# EAGLE design nano (EAGLE 7.6.0)
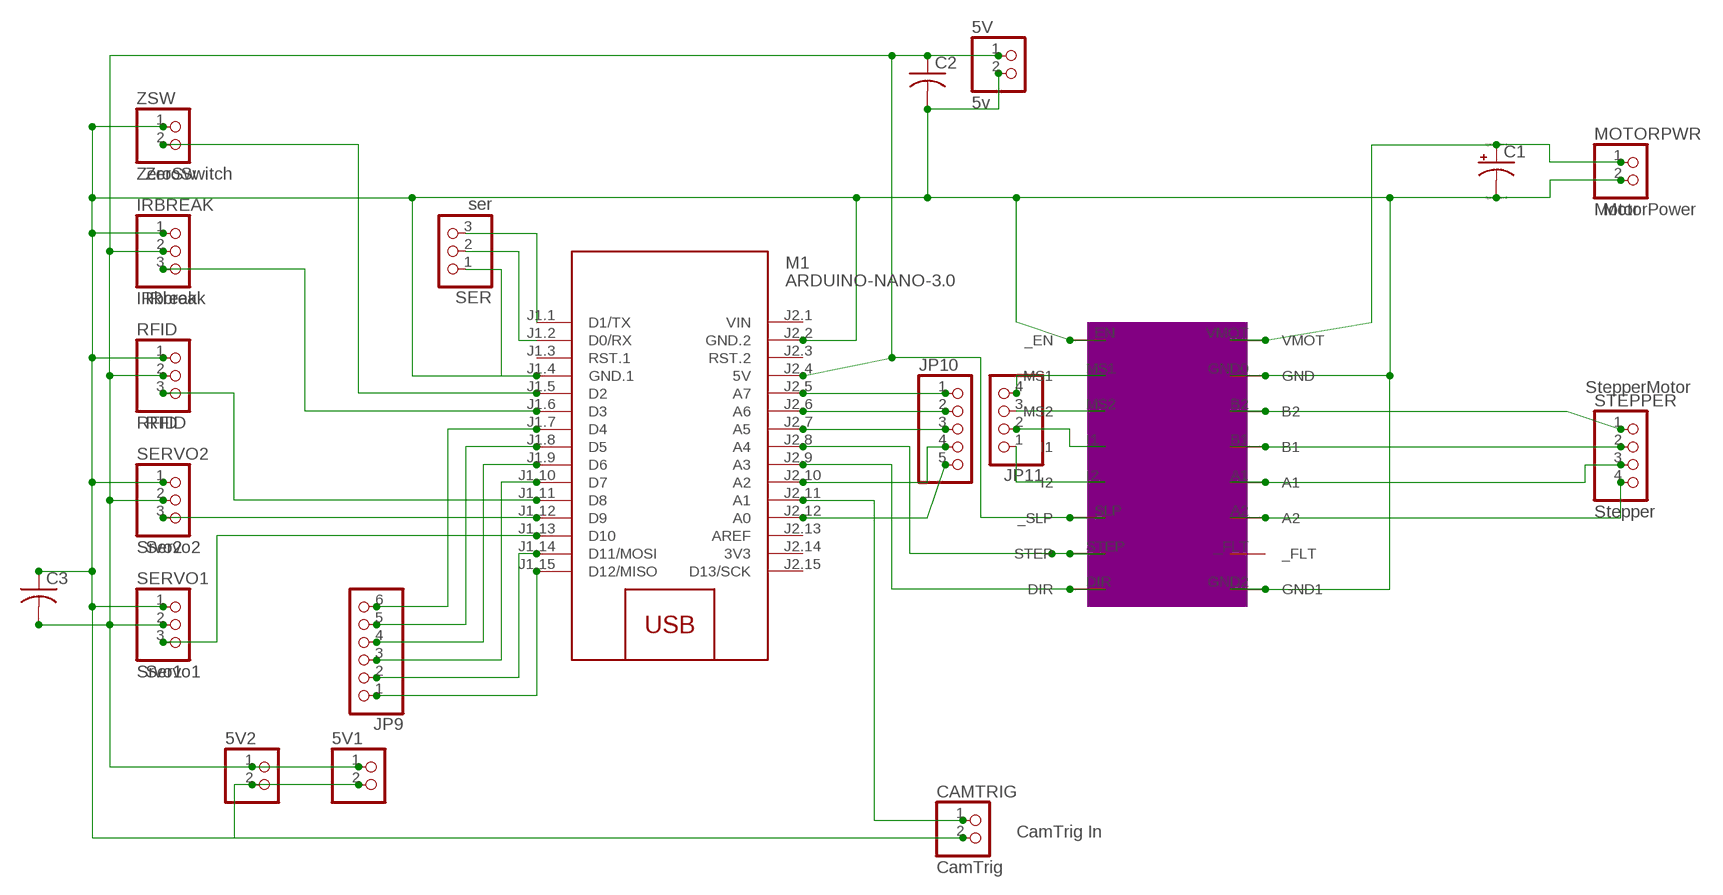
[diagram p0: schematic, sheet 1]

## Parts
5V  5v  PINHD-1X2  [1X02]
5V1  PINHD-1X2  [1X02]
5V2  PINHD-1X2  [1X02]
C1  CPOL-USE5-5  [E5-5]
C2  C-USC0805  [C0805]
C3  C-USC0805  [C0805]
CAMTRIG  CamTrig  PINHD-1X2  [1X02]
IRBREAK  IRbreak  PINHD-1X3  [1X03]
JP9  PINHD-1X6  [1X06]
JP10  PINHD-1X5  [1X05]
JP11  PINHD-1X4  [1X04]
M1  ARDUINO-NANO-3.0  [ARDUINO-NANO-3.0]
MOTORPWR  Motor  PINHD-1X2  [1X02]
RFID  RFID  PINHD-1X3  [1X03]
SER  ser  PINHD-1X3  [1X03]
SERVO1  Srvo1  PINHD-1X3  [1X03]
SERVO2  Srvo2  PINHD-1X3  [1X03]
STEPPER  Stepper  PINHD-1X4  [1X04]
U$1  MP6500  [MP6500]
ZSW  ZeroSw  PINHD-1X2  [1X02]

## Nets
N$1: C1.+ MOTORPWR.1 U$1.VMOT
N$2: JP9.1 M1.J1.15(D12/MISO)
N$3: JP11.4 U$1.MS1
N$4: STEPPER.4 U$1.A2
N$5: STEPPER.3 U$1.A1
N$6: STEPPER.2 U$1.B1
N$7: STEPPER.1 U$1.B2
N$8: JP9.2 M1.J1.14(D11/MOSI)
N$9: JP9.3 M1.J1.10(D7)
N$10: M1.J1.12(D9) SERVO2.3
N$11: M1.J1.13(D10) SERVO1.3
N$12: M1.J1.5(D2) ZSW.2
N$13: IRBREAK.3 M1.J1.6(D3)
N$14: M1.J1.11(D8) RFID.3
N$15: CAMTRIG.1 M1.J2.11(A1)
N$16: M1.J2.9(A3) U$1.DIR
N$17: M1.J2.8(A4) U$1.STEP
N$18: JP9.4 M1.J1.9(D6)
N$19: 5V1.1 5V2.1 5V.1 C2.1 C3.2 IRBREAK.2 M1.J2.4(5V) RFID.2 SERVO1.2 SERVO2.2 U$1._SLP
N$20: JP9.5 M1.J1.8(D5)
N$21: JP9.6 M1.J1.7(D4)
N$22: JP10.1 M1.J2.5(A7)
N$23: JP10.2 M1.J2.6(A6)
N$24: JP10.3 M1.J2.7(A5)
N$25: JP10.4 M1.J2.10(A2)
N$26: JP10.5 M1.J2.12(A0)
N$27: 5V1.2 5V2.2 5V.2 C1.- C2.2 C3.1 CAMTRIG.2 IRBREAK.1 M1.J1.4(GND.1) M1.J2.2(GND.2) MOTORPWR.2 RFID.1 SER.1 SERVO1.1 SERVO2.1 U$1._EN U$1.GND0(GND) U$1.GND2(GND1) ZSW.1
N$28: JP11.3 U$1.MS2
N$29: JP11.2 U$1.I1
N$30: JP11.1 U$1.I2
N$31: M1.J1.1(D1/TX) SER.3
N$32: M1.J1.2(D0/RX) SER.2
Unconnected: M1.J1.3(RST.1) M1.J2.3(RST.2) M1.J2.13(AREF) M1.J2.15(D13/SCK) U$1._FLT

## Notes on the sheet
- ZeroSwitch
- MotorPower
- IRbreak
- StepperMotor
- RFID
- Servo2
- Servo1
- CamTrig In

## Power pins joined to a net without a drawn wire
3V3: M1.J2.14(3V3)
VIN: M1.J2.1(VIN)

## Library data of the parts
5V 5V1 5V2 CAMTRIG MOTORPWR ZSW = pinhead:PINHD-1X2: PIN HEADER
C1 = resistor:CPOL-US: POLARIZED CAPACITOR, American symbol
C2 C3 = resistor:C-US: CAPACITOR, American symbol
IRBREAK RFID SER SERVO1 SERVO2 = pinhead:PINHD-1X3: PIN HEADER
JP9 = pinhead:PINHD-1X6: PIN HEADER
JP10 = pinhead:PINHD-1X5: PIN HEADER
JP11 STEPPER = pinhead:PINHD-1X4: PIN HEADER
M1 = diy-modules:ARDUINO-NANO-3.0: Arduino Nano 3.0 and compatible devices More details available here: https://www.arduino.cc/en/Main/ArduinoBoardNano Click here to find device on ebay.com <http://www.ebay.com/sch/arduino+nano>
U$1 = mp6500:MP6500

## Board
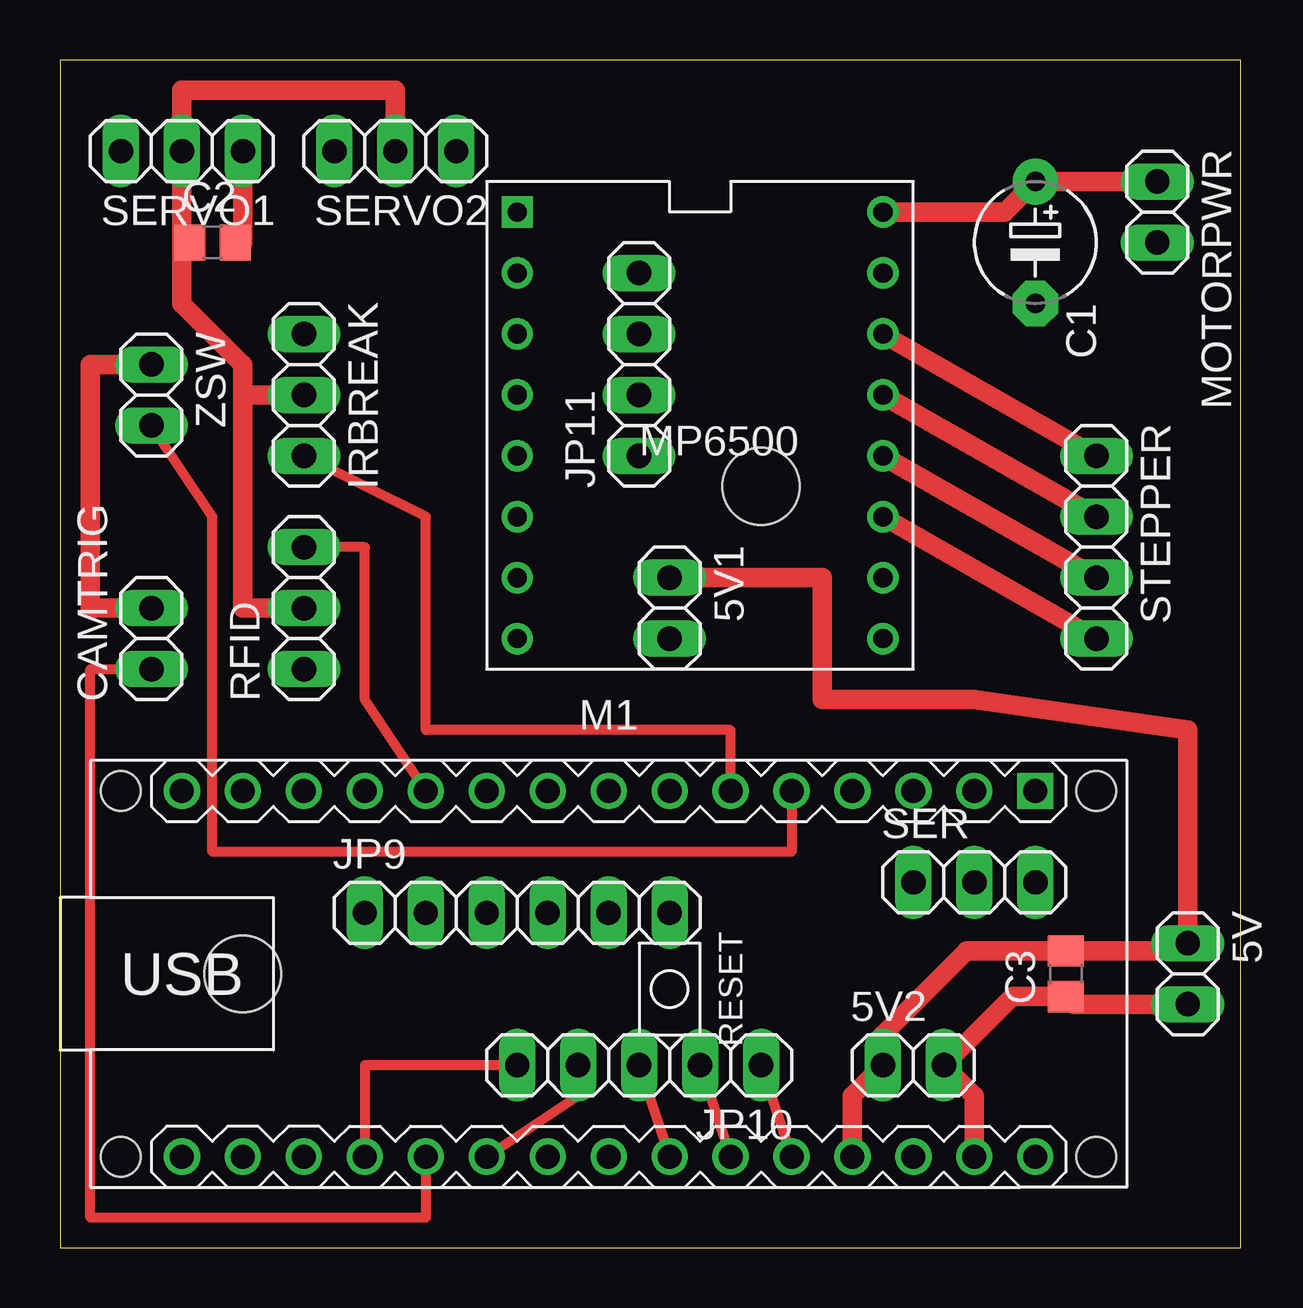
[diagram p1: board, top side]
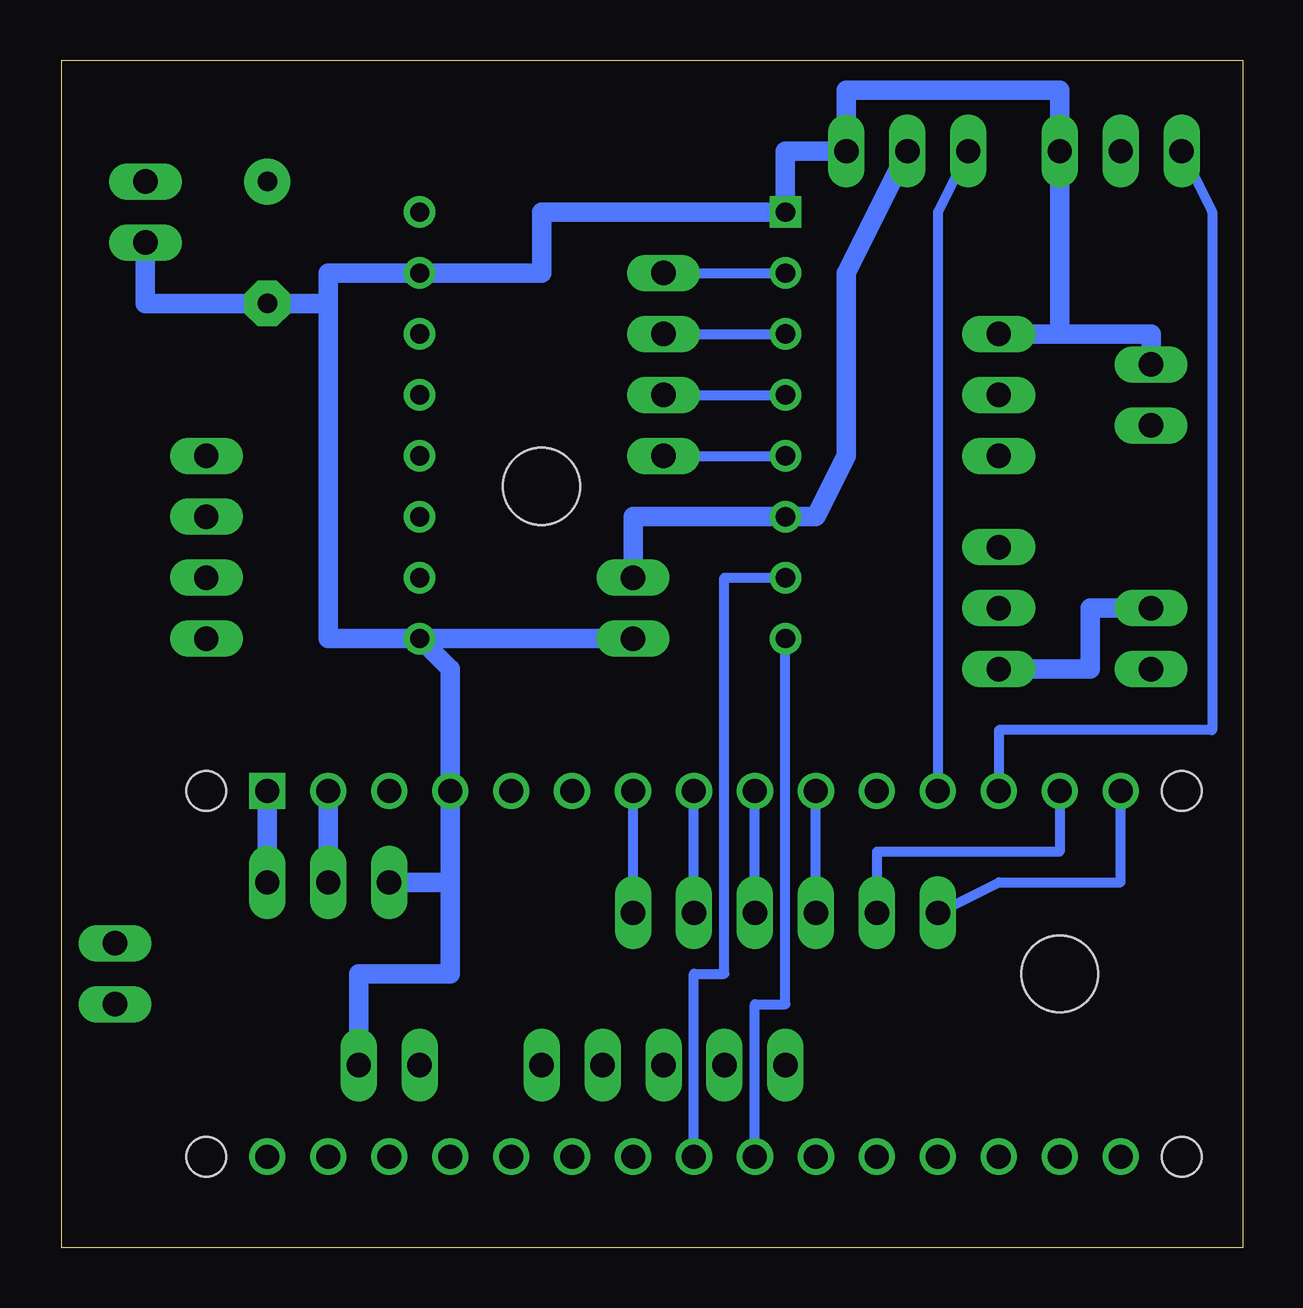
[diagram p2: board, bottom side, seen from below]

Size 49.2 x 49.52 mm. Coordinates in mm from the lower left corner, seen from the top.
Outline: 0,0 49.2,0 49.2,49.52 0,49.52 0,0
Copper layers (1*16): Top 0.035mm / dielectric 1.5mm / Bottom 0.035mm
Design rules "default": minimum track width 10mil, minimum drill 24mil, track to track 8mil, track to pad 8mil, pad to pad 8mil, via to via 8mil, smd to smd 8mil, copper to edge 40mil, drill to drill 8mil, minimum pad ring 10mil, minimum via ring 8mil, stop-mask expansion 4mil, vias tented up to drill 0mil, thermal gap 10mil
Holes 3.2 mm at 29.21,31.75 7.62,11.43

### Footprints (pad centres in the part's own frame; a part is rotated, then mirrored left to right if it is on the bottom)
1X02 = drill 1.016 long: 1 -1.27,0; 2 1.27,0
E5-5 = drill 0.813 pad 1.905: + -2.54,0 | drill 0.813 pad 1.905 octagon: - 2.54,0
C0805 = smd 1.3 x 1.5: 1 -0.95,0; 2 0.95,0
1X03 = drill 1.016 long: 1 -2.54,0; 2 0,0; 3 2.54,0
1X06 = drill 1.016 long: 1 -6.35,0; 2 -3.81,0; 3 -1.27,0; 4 1.27,0; 5 3.81,0; 6 6.35,0
1X05 = drill 1.016 long: 1 -5.08,0; 2 -2.54,0; 3 0,0; 4 2.54,0; 5 5.08,0
1X04 = drill 1.016 long: 1 -3.81,0; 2 -1.27,0; 3 1.27,0; 4 3.81,0
ARDUINO-NANO-3.0 = drill 1 square: J1.1 17.78,7.62 | drill 1: J1.2 15.24,7.62; J1.3 12.7,7.62; J1.4 10.16,7.62; J1.5 7.62,7.62; J1.6 5.08,7.62; J1.7 2.54,7.62; J1.8 0,7.62; J1.9 -2.54,7.62; J1.10 -5.08,7.62; J1.11 -7.62,7.62; J1.12 -10.16,7.62; J1.13 -12.7,7.62; J1.14 -15.24,7.62; J1.15 -17.78,7.62; J2.1 17.78,-7.62; J2.2 15.24,-7.62; J2.3 12.7,-7.62; J2.4 10.16,-7.62; J2.5 7.62,-7.62; J2.6 5.08,-7.62; J2.7 2.54,-7.62; J2.8 0,-7.62; J2.9 -2.54,-7.62; J2.10 -5.08,-7.62; J2.11 -7.62,-7.62; J2.12 -10.16,-7.62; J2.13 -12.7,-7.62; J2.14 -15.24,-7.62; J2.15 -17.78,-7.62 | hole 1.651: -20.32,7.62; -20.32,-7.62; 20.32,-7.62; 20.32,7.62
MP6500 = drill 0.8 square: _EN 0,0 | drill 0.8: _FLT 15.24,-15.24; _SLP 0,-12.7; A1 15.24,-10.16; A2 15.24,-12.7; B1 15.24,-7.62; B2 15.24,-5.08; DIR 0,-17.78; GND0 15.24,-17.78; GND2 15.24,-2.54; I1 0,-7.62; I2 0,-10.16; MS1 0,-2.54; MS2 0,-5.08; STEP 0,-15.24; VMOT 15.24,0

### Placement (x,y rotation side)
5V  46.99,11.43 270 top
5V1  25.4,26.67 270 top
5V2  35.56,7.62 0 top
C1  40.64,41.91 270 top
C2  6.35,41.91 0 top
C3  41.91,11.43 90 top
CAMTRIG  3.81,25.4 90 top
IRBREAK  10.16,35.56 270 top
JP9  19.05,13.97 0 top
JP10  24.13,7.62 180 top
JP11  24.13,36.83 90 top
M1  22.86,11.43 0 top
MOTORPWR  45.72,43.18 270 top
RFID  10.16,26.67 90 top
SER  38.1,15.24 0 top
SERVO1  5.08,45.72 180 top
SERVO2  13.97,45.72 180 top
STEPPER  43.18,29.21 270 top
U$1  19.05,43.18 0 top
ZSW  3.81,35.56 270 top

### Tracks (layer width: path | path; a pad name or v marks a point on that pad's centre or on a via)
N$1
  Top 0.813: MOTORPWR.1 C1.+ 39.37,43.18 U$1.VMOT
N$2
  Bottom 0.406: JP9.1 10.16,15.24 5.08,15.24 M1.J1.15
N$3
  Bottom 0.406: JP11.4 U$1.MS1
N$4
  Top 0.813: U$1.A2 STEPPER.4
N$5
  Top 0.813: U$1.A1 STEPPER.3
N$6
  Top 0.813: U$1.B1 STEPPER.2
N$7
  Top 0.813: U$1.B2 STEPPER.1
N$8
  Bottom 0.406: M1.J1.14 7.62,16.51 15.24,16.51 JP9.2
N$9
  Bottom 0.406: JP9.3 M1.J1.10
N$10
  Bottom 0.406: SERVO2.3 12.7,43.18 M1.J1.12
N$11
  Bottom 0.406: SERVO1.3 1.27,43.18 1.27,21.59 10.16,21.59 M1.J1.13
N$12
  Top 0.406: M1.J1.5 30.48,16.51 6.35,16.51 6.35,30.48 ZSW.2
N$13
  Top 0.406: M1.J1.6 27.94,21.59 15.24,21.59 15.24,30.48 IRBREAK.3
N$14
  Top 0.406: M1.J1.11 12.7,22.86 12.7,29.21 RFID.3
N$15
  Top 0.406: M1.J2.11 15.24,1.27 1.27,1.27 1.27,24.13 CAMTRIG.1
N$16
  Bottom 0.406: M1.J2.9 20.32,10.16 19.05,10.16 U$1.DIR
N$17
  Bottom 0.406: M1.J2.8 22.86,11.43 21.59,11.43 21.59,27.94 U$1.STEP
N$18
  Bottom 0.406: JP9.4 M1.J1.9
N$19
  Top 0.813: 5.08,41.91 SERVO1.2 5.08,48.26 13.97,48.26 SERVO2.2 | C2.1 5.08,41.91 | 5.08,41.91 5.08,39.37 7.62,36.83 7.62,35.56 | 7.62,35.56 IRBREAK.2 | RFID.2 7.62,26.67 7.62,35.56 | M1.J2.4 33.02,6.35 5V2.1 34.29,8.89 37.78,12.38 C3.2 46.67,12.38 5V.1 46.99,21.59 38.1,22.86 31.75,22.86 31.75,27.94 5V1.1
  Bottom 0.813: 5V1.1 25.4,30.48 U$1._SLP 17.78,30.48 16.51,33.02 16.51,40.64 SERVO2.2
N$20
  Bottom 0.406: JP9.5 M1.J1.8
N$21
  Bottom 0.406: JP9.6 M1.J1.7
N$22
  Top 0.406: JP10.1 M1.J2.5
N$23
  Top 0.406: JP10.2 M1.J2.6
N$24
  Top 0.406: JP10.3 M1.J2.7
N$25
  Top 0.406: JP10.4 21.59,6.35 M1.J2.10
N$26
  Top 0.406: JP10.5 12.7,7.62 M1.J2.12
N$27
  Top 0.813: C2.2 7.62,41.91 SERVO1.1 | ZSW.1 1.27,36.83 1.27,26.67 CAMTRIG.2 | 5V.2 42.23,10.16 C3.1 39.69,10.48 5V2.2 38.1,6.35 M1.J2.2
  Bottom 0.813: MOTORPWR.2 45.72,39.37 C1.- 38.1,39.37 | 38.1,39.37 38.1,40.64 U$1.GND2 29.21,40.64 29.21,43.18 U$1._EN 19.05,45.72 SERVO2.1 16.51,48.26 7.62,48.26 SERVO1.1 7.62,38.1 | IRBREAK.1 7.62,38.1 | ZSW.1 3.81,38.1 7.62,38.1 | 38.1,39.37 38.1,25.4 U$1.GND0 | U$1.GND0 33.02,24.13 M1.J1.4 33.02,15.24 | 33.02,15.24 33.02,11.43 36.83,11.43 5V2.2 | SER.1 33.02,15.24 | CAMTRIG.2 6.35,26.67 6.35,24.13 RFID.1 | 5V1.2 U$1.GND0
N$28
  Bottom 0.406: JP11.3 U$1.MS2
N$29
  Bottom 0.406: JP11.2 U$1.I1
N$30
  Bottom 0.406: JP11.1 U$1.I2
N$31
  Bottom 0.813: SER.3 M1.J1.1
N$32
  Bottom 0.813: SER.2 M1.J1.2

### Text on the board
tValues: + | + | - | + | - | - | - | + | - | + | - | + | -